# Altium schematic sheet LM2976.SchDoc
size A; SheetNumber: 3; SheetTotal: 5
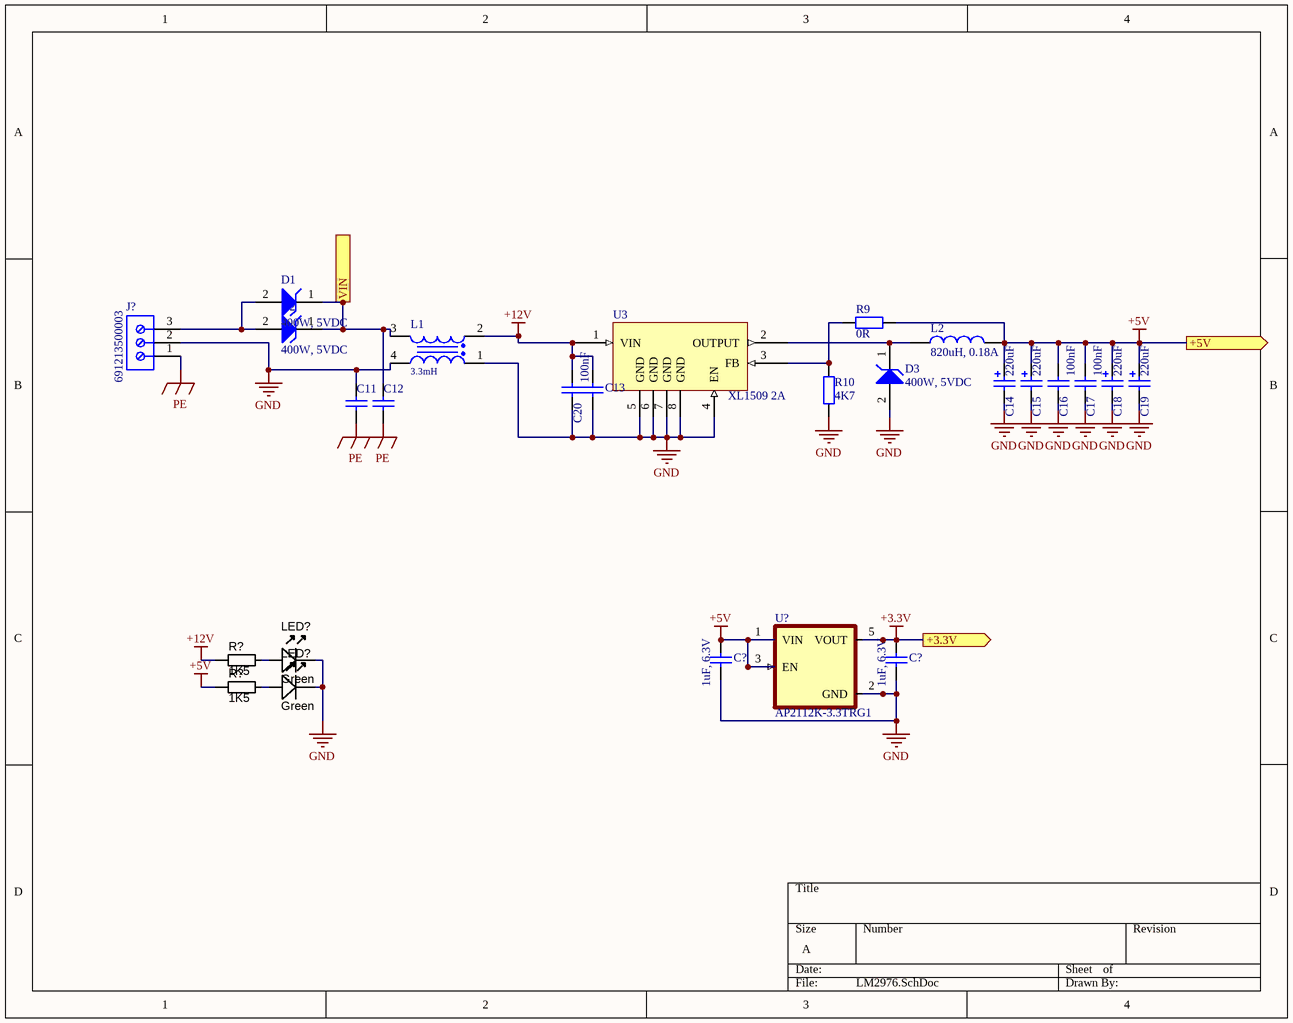
[diagram p0: LM2976.SchDoc]

## Parts
(Parts that share a designator on the sheet are numbered #1, #2 ... from top to bottom, then left to right.)
C11  Capacitor Ceramic 2KV  [103/2KV]  (value not drawn)
C12  Capacitor Ceramic 2KV  [103/2KV]  (value not drawn)
C13  R82DC3100DQ50J  [CAP FILM 5mm]  (value not drawn)
C14  220uF  [CAP_ALU_THT_8x11.5]
C15  220uF  [CAP_ALU_THT_8x11.5]
C16  100nF  [CAP_0805]
C17  100nF  [CAP_0805]
C18  220uF  [CAP_ALU_THT_8x11.5]
C19  220uF  [CAP_ALU_THT_8x11.5]
C20  100nF  [CAP_0805]
C?#1  1uF, 6.3V  [WCAP-CSGP_0603_L1.6W0.8H0.8_Reflow]
C?#2  1uF, 6.3V  [WCAP-CSGP_0603_L1.6W0.8H0.8_Reflow]
D1  400W, 5VDC  [WE-TVSP_DO-214AC_Unidirectional]
D2  400W, 5VDC  [WE-TVSP_DO-214AC_Unidirectional]
D3  400W, 5VDC  [WE-TVSP_DO-214AC_Unidirectional]
J?  691213500003  [691213500003]
L1  3.3mH  [WE-TFC_UU9.8V]
L2  820uH, 0.18A  [WE-PD HV_7332]
LED?#1  Green  [LED-0603-GREEN]
LED?#2  Green  [LED-0603-GREEN]
R9  0R  [RES_0603]
R10  4K7  [RES_0603]
R?#1  value 1K5  [RESC1608X55N]  (hidden comment: Thick Film)
R?#2  value 1K5  [RESC1608X55N]  (hidden comment: Thick Film)
U3  XL1509 2A  [SOIC-8]
U?  AP2112K-3.3TRG1  [SOT25]

## Ports
+3.3V (out), +5V (out), VIN (out)

## Nets
+3.3V: C?#2.2 U?.5(VOUT) ; port +3.3V
+5V: C14.2(P) C15.2(P) C16.2 C17.2 C18.2(P) C19.2(P) C?#1.2 L2.2 R9.1 R?#2.1 U?.1(VIN) U?.3(EN) ; port +5V
+12V: C13.2 C20.2 L1.2 R?#1.1 U3.1(VIN)
GND: C11.2 C13.1 C14.1(N) C15.1(N) C16.1 C17.1 C18.1(N) C19.1(N) C20.1 C?#1.1 C?#2.1 D3.2(A) J?.2 L1.1 L1.4 LED?#1.K LED?#2.K R10.2 U3.4(EN) U3.5(GND) U3.6(GND) U3.7(GND) U3.8(GND) U?.2(GND)
PE: C11.1 C12.1 J?.1
VIN: C12.2 D1.1(K) D2.1(K) L1.3 ; port VIN
NetD1_2: D1.2(A) D2.2(A) J?.3
NetD3_1: D3.1(K) L2.1 U3.2(OUTPUT)
NetLED?#1_A: LED?#1.A R?#1.2
NetLED?#2_A: LED?#2.A R?#2.2
NetR9_2: R9.2 R10.1 U3.3(FB)

## Library data of the parts
C11 C12 = Cap2KV: Published: 8-Jun-2000; LatestRevisionDate: 17-Jul-2002; LatestRevisionNote: Re-released for DXP Platform.; PackageReference: RAD-0.3; Publisher: Altium Limited
C13 = CAP FILM: R82, Film, Metallized Polyester Stacked, Automotive Grade, 0.1 uF, 5%, 40 VAC, 63 VDC, 105C, -55C, 85C, 0.8 % , 15 GOhms, 160 V/us, 7000 pH, 0.214 g, 7.2mm, 6.5mm, 2.5mm, Lead Spacing = 5mm, 3500; Manufacturer_Name: KEMET; Manufacturer_Part_Number: R82DC3100DQ50J; Mouser Part Number: 80-R82DC3100DQ50J; Mouser Price/Stock: https://www.mouser.co.uk/ProductDetail/KEMET/R82DC3100DQ50J?qs=06HLYMEcjuXxjUSf9lh2BQ%3D%3D; Arrow Part Number: R82DC3100DQ50J; Arrow Price/Stock: https://www.arrow.com/en/products/r82dc3100dq50j/kemet-corporation?region=europe; Datasheet Link: https://content.kemet.com/datasheets/KEM_F3101_R82.pdf
C14 C15 C18 C19 = CAP_ALU_THT: WCAP-ATG8 THT Aluminum Electrolytic Capacitors; Part Number: 860010272001; Capacitance: 22uF; Dissipation Factor: 19%; Endurance: 2000h; Leakage Current: 3uA; Ripple Current max.: 66mA; Capacitance Tolerance: +/-20%; Rated Voltage: 10VDC; Technical Reference: ATBC110220M010DSPA3B000; ComponentLink1Description: Manufacturer; ComponentLink1URL: http://www.we-online.de; ComponentLink2Description: Datasheet; ComponentLink2URL: https://katalog.we-online.com/pbs/datasheet/860010272001.pdf; Length: 11mm; Mounting Technology: THT; Operating Temperature: -40 to +85degC; Packaging: Ammo Pack; Published Date: August 2019; Diameter: 5mm; Publisher: Wurth Elektronik
C16 C17 C20 = CAP_SMD: WCAP-CSGP General Purpose Ceramic Capacitors; Part Number: 885012005001; Rated Voltage: 10VDC; Isolation Resistance: >=10GOhm; Ceramic Type: NP0; Capacitance Tolerance: +/-0.5pF; Dissipation Factor: Q>=400+20C; Capacitance: 1pF; Technical Reference: NP004021R0D010DFCT10000; ComponentLink1Description: Manufacturer; ComponentLink1URL: http://www.we-online.de; ComponentLink2Description: Datasheet; ComponentLink2URL: https://katalog.we-online.com/pbs/datasheet/885012005001.pdf; Operating Temperature: -55 to +125degC; Packaging: Tape and Reel; Publisher: Wurth Elektronik; Published Date: August 2019; Height: 0.5mm +/-0.05mm; Mounting Technology: SMT; Size: 0402
C?#1 C?#2 = 885012206002: WCAP-CSGP Multilayer Ceramic Chip Capacitor, General Purpose, size 0603, X7R, 1uF, 6.3V; Manufacturer: Wurth Elektronik; Capacitance Tolerance: +/-10%; Dissipation Factor: 10%; Isolation Resistance: 0.1GOhm; Technical Reference: X7R0603105K6R3DFCT10000; Capacitance: 1uF; Ceramic Type: X7R; ComponentLink1Description: Manufacturer Link; ComponentLink1URL: http://www.we-online.de; ComponentLink2Description: Datasheet; ComponentLink2URL: https://www.we-online.com/catalog/datasheet/885012206002.pdf; Height: 0.8mm; Length: 1.6mm; Manufacturer Part Number: 885012206002; Mounting Technology: SMT; Operating Temperature max.: 125C; Operating Temperature min.: -55C; Packaging: Tape and Reel; Rated Voltage: 6.3V; Size: 0603; Width: 0.8mm
D1-D3 = 824500500: WE-TVSP SMT Power TVS Diode, DO-214AC, 400W, 5VDC, Unidirectional; Manufacturer: Wurth Elektronik; (Reverse) Breakdown Voltage: 6.7V; (Reverse) Peak Pulse Current: 43.5A; Clamping Voltage: 9.2V; DC Operating Voltage: 5V; ComponentLink1Description: Manufacturer; Mounting Technology: SMT; Operating Temperature: -65 to +150degC; Packaging: Tape and Reel; ComponentLink2URL: https://www.we-online.com/catalog/datasheet/824500500.pdf; ComponentLink2Description: Datasheet; Manufacturer Part Number: 824500500; Polarity: Unidirectional; ComponentLink1URL: http://www.we-online.de; Published Date: July 2020; Size: DO-214AC; Power Dissipation: 400W
J? = 691213500003: WR-TBL Serie 2135 Vertical Entry Modular, Rising Cage Clamp, THT, pitch 5.08mm, 3p; Manufacturer: Wurth Elektronik; Modularity: Yes; PCB/Cable/Panel: PCB; Pin Number: 3; Rated Current [UL]: 14A; Working Voltage [UL]: 300VAC; ComponentLink1Description: Manufacturer; ComponentLink1URL: http://www.we-online.de; ComponentLink2URL: https://katalog.we-online.de/em/datasheet/691213500003.pdf; ComponentLink2Description: Datasheet; Mounting Technology: THT; Manufacturer Part Number: 691213500003; Packaging: Box; Operating Temperature: -30 to +120degC; Pitch: 5.08mm; Published Date: Feburary 2021; Type: Vertical; Application: Rising Cage Clamp
L1 = 744862033: WE-TFC Common Mode Power Line Choke, Vertical, size UU9.8V, 3.3mH, 0.8A, 400VAC; Manufacturer: Wurth Elektronik; DC Resistance max.: 0.51Ohm; Insulation Test Voltage: 3000VAC; ComponentLink1Description: Manufacturer; ComponentLink1URL: http://www.we-online.de; ComponentLink2Description: Datasheet; ComponentLink2URL: https://www.we-online.com/catalog/datasheet/744862033.pdf; Manufacturer Part Number: 744862033; Published Date: September 2020; Operating Temperature: -40 to +125degC; Mounting Technology: THT; Packaging: Tray; Inductance: 3.3mH; Rated Voltage: 400VAC; Rated Current: 0.8A; Size: UU9.8V
L2 = 7687789821: WE-PD HV SMT High Voltage Power Inductor, size 7332, 820uH, 0.18A; Manufacturer: Wurth Elektronik; Operating Voltage: 400V; DC Resistance max.: 8.2Ohm; Self Resonant Frequency: 3.3MHz; Saturation Current: 0.23A; DC Resistance typ.: 6.7Ohm; ComponentLink1Description: Manufacturer; ComponentLink1URL: http://www.we-online.de; ComponentLink2Description: Datasheet; ComponentLink2URL: https://www.we-online.com/catalog/datasheet/7687789821.pdf; Packaging: Tape and Reel; Published Date: April 2020; Rated Current: 0.18A; Inductance: 820uH; Mounting Technology: SMT; Manufacturer Part Number: 7687789821; Operating Temperature: -40 to +125degC; Size: 7332
LED?#1 LED?#2 = LED_SMD_Green_0603_525nm_350mcd: LED 0603 SMD Green 525nm 350mcd 20mA; Manufacturer 1: Kingbright; Manufacturer Part Number 1: APT1608ZGCK; Material: InGaN; Ratings: 200mcd min; 350 mcd typ @ 20mA; Voltage - Forward (Vf) @ 10mA: 3.1V; Viewing Angle: 120°; Lens Style/Size: Rectangle with Flat Top, 1.2mm x 0.8mm; Voltage - Forward (Vf) @ 20mA: 3.3V; SCDType: source; Package / Case: 0603 (1608 metric); Color: Green; Current - Test: 20mA; Manufacturer 2: Kingbright Company LLC; Manufacturer Part Number 2: APT1608-WAP24; Supplier 1: Mouser; Supplier Part Number 1: 604-APT1608ZGCK; ComponentLink1URL: http://www.mouser.com/ds/2/216/APT1608ZGCK-262051.pdf; ComponentLink1Description: http://www.mouser.com/ds/2/216/APT1608ZGCK-262051.pdf; ComponentLink2Description: APT1608-WAP24 Datasheet; ComponentLink2URL: \\SVFI2\PBLShare\Eng\Electrical Engineering\Hardware\Altium\Libraries and Templates\Unreleased Components\Part Number Request 2013-10-02\APT1608-WAP24(Ver.1B).pdf
R9 R10 = RES_SMD: WRIS-KSKE SMT Thick Film Resistor, 0.125W; Manufacturer: Wurth Elektronik; Manufacturer Part Number: 560050310010; Rated Current: 0.5A; Resistance: 0.5Ohm; Temperature Coefficient of Resistance: 200ppm/degC; Technical Reference: KE0402R500F108HAATH0000; Resistance Tolerance: +/-1%; ComponentLink1Description: Manufacturer; ComponentLink1URL: http://www.we-online.de; ComponentLink2Description: Datasheet; ComponentLink2URL: https://www.we-online.com/catalog/datasheet/560050310010.pdf; Published Date: May 2020; Rated Power: 0.125W; Height: 0.35mm; Operating Temperature: -55 to +155degC; Mounting Technology: SMT; Packaging: Tape and Reel; Size: 0402; Length: 1mm; Width: 0.5mm
R?#1 R?#2 = RES_1K5_0603_5%: Resistor SMD chip 1.5k Ohm 0.1W 5% 0603; Manufacturer 1: Yageo; Manufacturer Part Number 1: RC0603JR-071K5L; Ratings: 1/10 W; SCDType: spec; Package / Case: 0603 (1608 metric); Tolerance: ±5%; Material: thick film; Supplier 1: Digi-Key; Supplier Part Number 1: 311-1.5KGRCT-ND
U3 = XL1509: 4.5V to 40V Input,150 KHz fixed frequency / PWM buck (step-down) DC/DC converter
U? = AP2112K-3.3TRG1: AP2112 Series 0.6 A 3.3 V Fixed Output SMT LDO Linear Regulator - SOT23-5; Value: *; Availability: Unavailable; Price: None; Package: None; MP: AP2112K-3.3TRG1